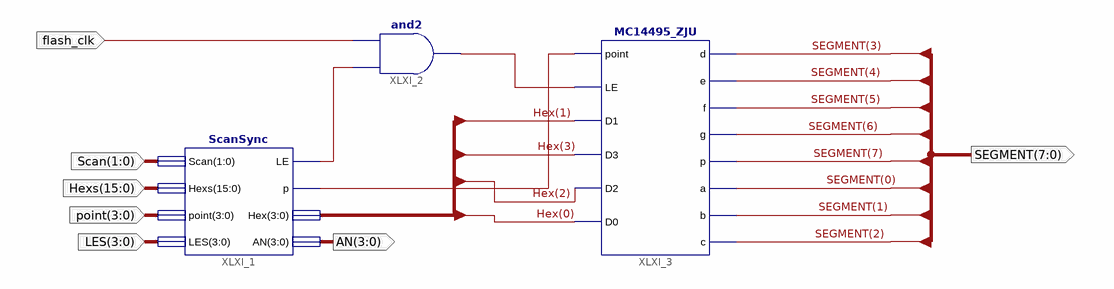
[diagram p0: schematic sheet 1]
// Xilinx ISE schematic Seg7_Dev16.sch (kintex7) as structural Verilog: 3 symbols, 7 ports
module Seg7_Dev16 (
  input  [1:0] Scan,
  input  [15:0] Hexs,
  input  [3:0] point,
  input  [3:0] LES,
  input  flash_clk,
  output [3:0] AN,
  output [7:0] SEGMENT
);

  wire XLXN_7, XLXN_8, XLXN_9;
  wire [3:0] Hex;

  ScanSync XLXI_1 (.Scan(Scan), .Hexs(Hexs), .point(point), .LES(LES), .LE(XLXN_7), .p(XLXN_8), .Hex(Hex), .AN(AN));
  and XLXI_2 (XLXN_9, XLXN_7, flash_clk);
  MC14495_ZJU XLXI_3 (
    .point(XLXN_8), .LE(XLXN_9), .D1(Hex[1]), .D3(Hex[3]), .D2(Hex[2]), .D0(Hex[0]), .d(SEGMENT[3]),
    .e(SEGMENT[4]), .f(SEGMENT[5]), .g(SEGMENT[6]), .p(SEGMENT[7]), .a(SEGMENT[0]), .b(SEGMENT[1]),
    .c(SEGMENT[2]));
endmodule
